# Altium project dashcam_cpu_v2.0.PrjPcb (part 3 of 13)

## Sheet mx8m_io.SchDoc
size A2; SheetNumber: 7; SheetTotal: 15
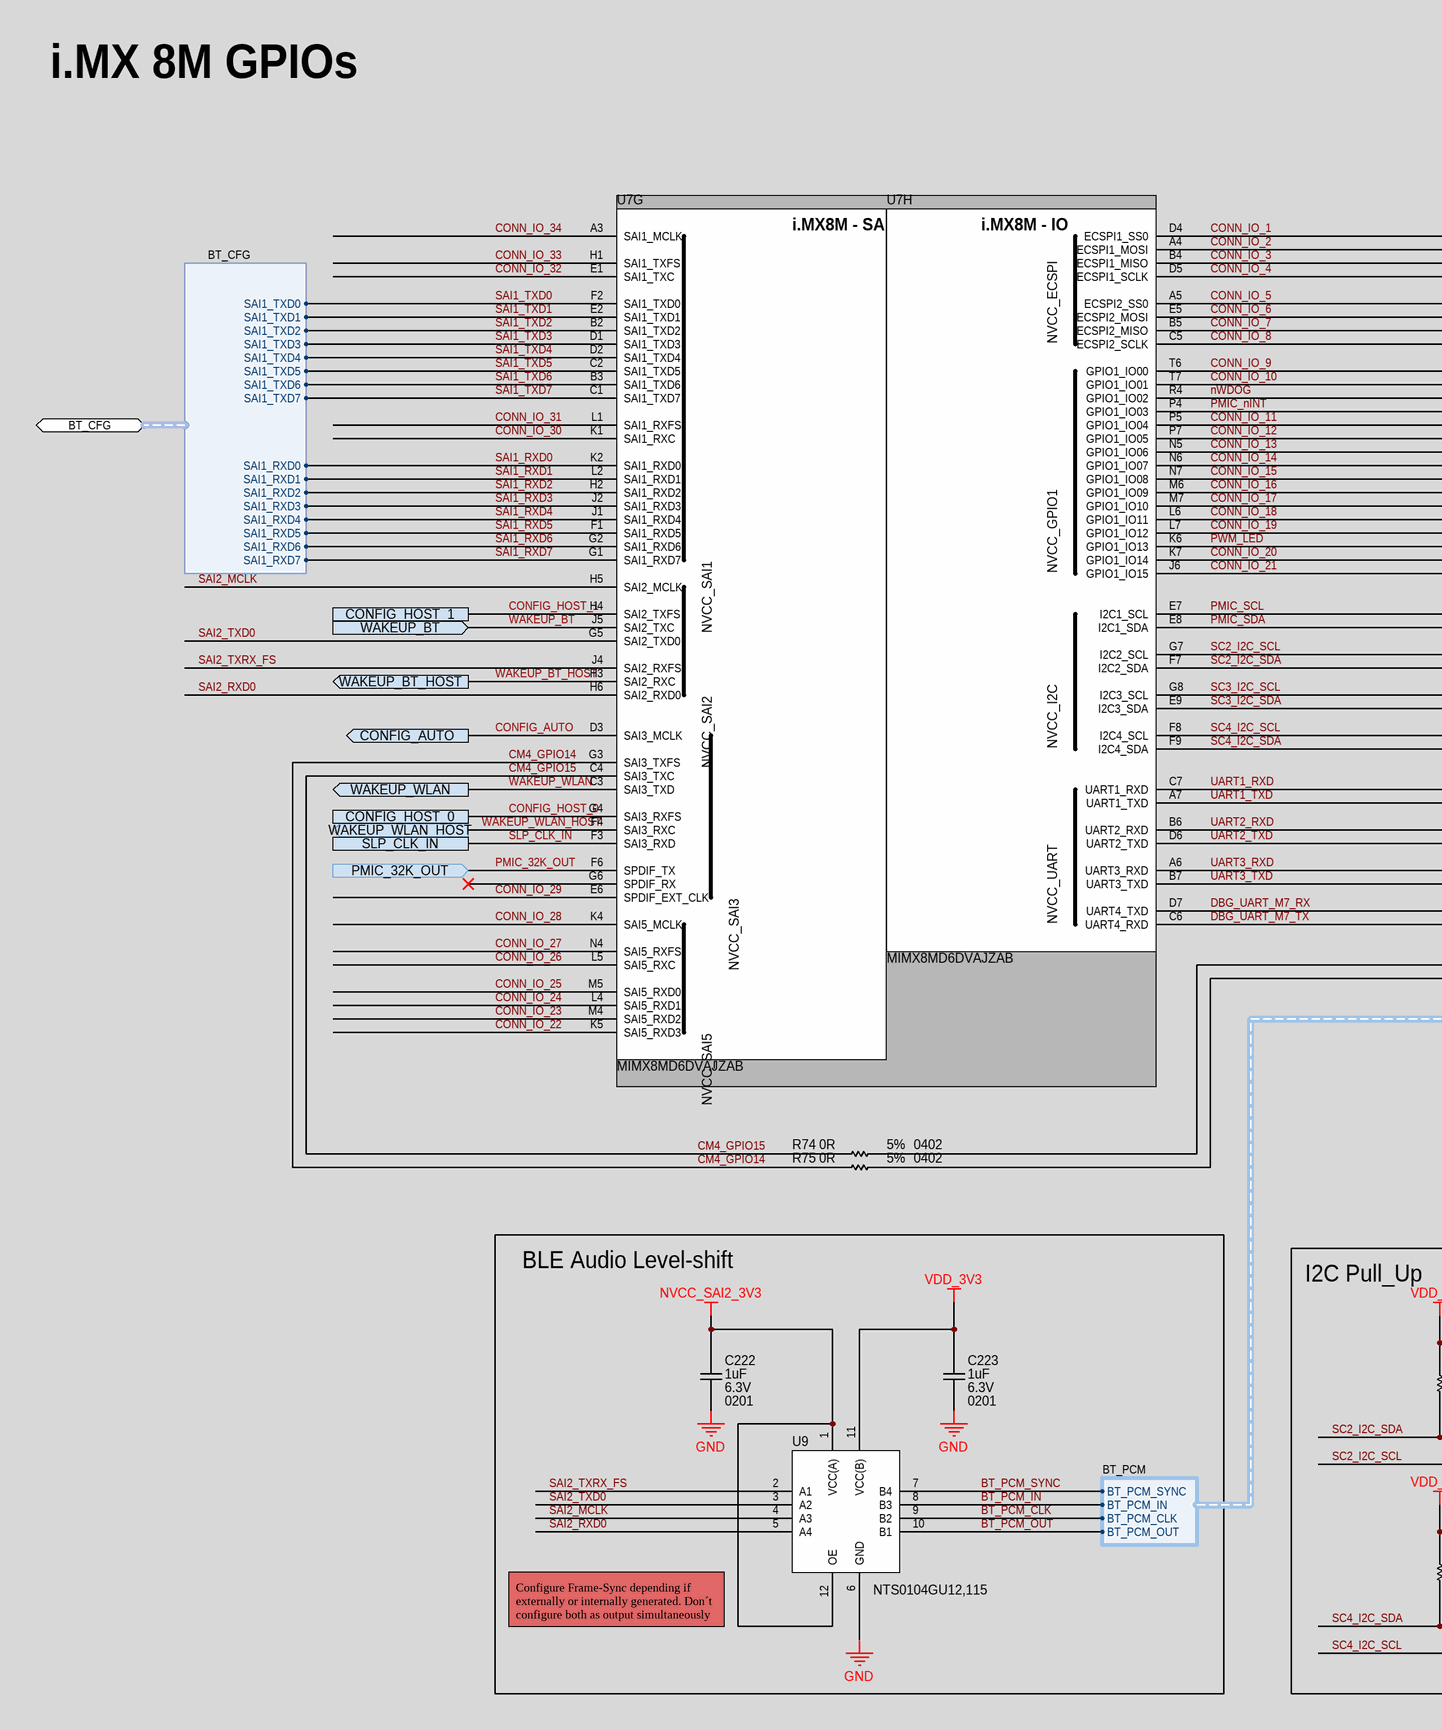
[diagram p4: mx8m_io.SchDoc, left]
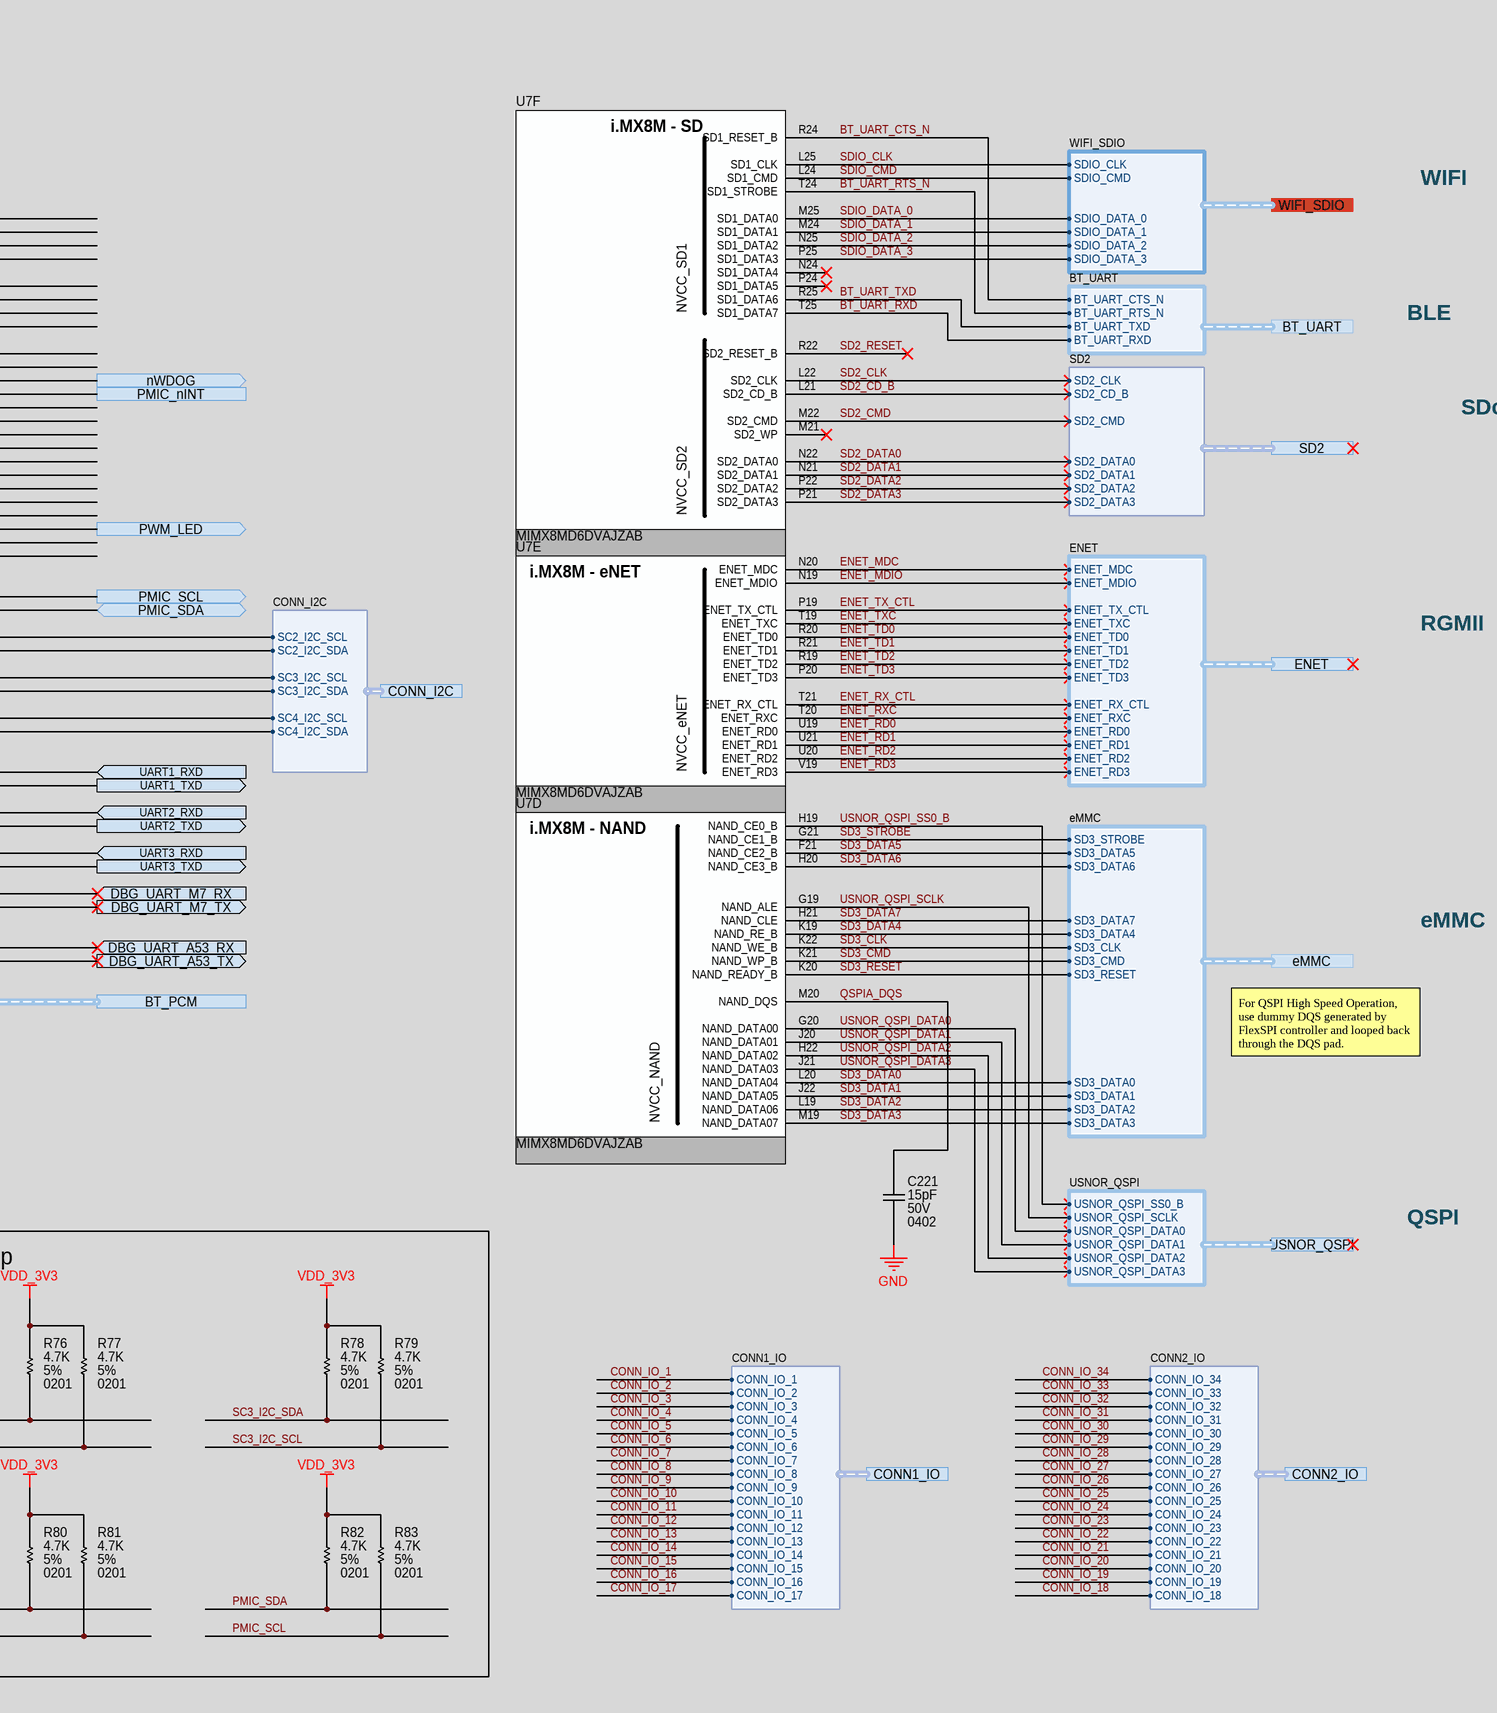
[diagram p5: mx8m_io.SchDoc, right]

### Parts
C221  Voltage: 50V  Capacitance: 15pF  Case/Package: 0402  [CAP_0402_CAPC1005X05N]  (hidden comment: CC0402JRNPO9BN150)
C222  Voltage Rating (DC): 6.3V  Capacitance: 1uF  Case/Package: 0201  [CAP_0201_CAPC0603X03N]  (hidden comment: 02016D105MAT2A)
C223  Voltage Rating (DC): 6.3V  Capacitance: 1uF  Case/Package: 0201  [CAP_0201_CAPC0603X03N]  (hidden comment: 02016D105MAT2A)
R74  Case Code (Imperial): 0402  Tolerance: 5%  Resistance: 0R  [RES_0402_RESC1005X04N]  (hidden comment: ERJ-2GE0R00X)
R75  Case Code (Imperial): 0402  Tolerance: 5%  Resistance: 0R  [RES_0402_RESC1005X04N]  (hidden comment: ERJ-2GE0R00X)
R76  Tolerance: 5%  Resistance: 4.7K  Case/Package: 0201  [RES_0201_RESC0603X02N]  (hidden comment: RK73B1HTTC472J)
R77  Tolerance: 5%  Resistance: 4.7K  Case/Package: 0201  [RES_0201_RESC0603X02N]  (hidden comment: RK73B1HTTC472J)
R78  Tolerance: 5%  Resistance: 4.7K  Case/Package: 0201  [RES_0201_RESC0603X02N]  (hidden comment: RK73B1HTTC472J)
R79  Tolerance: 5%  Resistance: 4.7K  Case/Package: 0201  [RES_0201_RESC0603X02N]  (hidden comment: RK73B1HTTC472J)
R80  Tolerance: 5%  Resistance: 4.7K  Case/Package: 0201  [RES_0201_RESC0603X02N]  (hidden comment: RK73B1HTTC472J)
R81  Tolerance: 5%  Resistance: 4.7K  Case/Package: 0201  [RES_0201_RESC0603X02N]  (hidden comment: RK73B1HTTC472J)
R82  Tolerance: 5%  Resistance: 4.7K  Case/Package: 0201  [RES_0201_RESC0603X02N]  (hidden comment: RK73B1HTTC472J)
R83  Tolerance: 5%  Resistance: 4.7K  Case/Package: 0201  [RES_0201_RESC0603X02N]  (hidden comment: RK73B1HTTC472J)
U7  MIMX8MD6DVAJZAB  [IC_MPU_BGA621C65P25X25_1700X1700X218]  (parts D,E,F,G,H of 14)
U9  NTS0104GU12,115  [IC_LEVEL_TRASLATOR_XQFN12_0P4_1P8X2P1]

### Blocks framed on the sheet
BLE Audio Level-shift: C222 C223 U9
I2C Pull_Up: R76-R83

### Ports
BT_CFG (bidir, harness BT_CFG), BT_PCM (harness BT_PCM), BT_UART (harness BT_UART), CONFIG_AUTO (out), CONFIG_HOST_0, CONFIG_HOST_1, CONN1_IO (harness CONN1_IO), CONN2_IO (harness CONN2_IO), CONN_I2C (harness CONN_I2C), DBG_UART_A53_RX (in), DBG_UART_A53_TX (out), DBG_UART_M7_RX (in), DBG_UART_M7_TX (out), eMMC (harness eMMC), ENET (harness ENET), nWDOG (out), PMIC_32K_OUT (in), PMIC_nINT, PMIC_SCL (out), PMIC_SDA (bidir), PWM_LED (out), SD2 (harness SD2), SLP_CLK_IN, UART1_RXD (in), UART1_TXD (out), UART2_RXD (in), UART2_TXD (out), UART3_RXD (in), UART3_TXD (out), USNOR_QSPI (harness USNOR_QSPI), WAKEUP_BT (in), WAKEUP_BT_HOST (out), WAKEUP_WLAN (out), WAKEUP_WLAN_HOST (out), WIFI_SDIO (harness WIFI_SDIO)

### Harnesses
WIFI_SDIO: SDIO_CLK, SDIO_CMD, SDIO_DATA_0, SDIO_DATA_1, SDIO_DATA_2, SDIO_DATA_3
BT_UART: BT_UART_CTS_N, BT_UART_RTS_N, BT_UART_TXD, BT_UART_RXD
SD2: SD2_CLK, SD2_CD_B, SD2_CMD, SD2_DATA0, SD2_DATA1, SD2_DATA2, SD2_DATA3
ENET: ENET_MDC, ENET_MDIO, ENET_TX_CTL, ENET_TXC, ENET_TD0, ENET_TD1, ENET_TD2, ENET_TD3, ENET_RX_CTL, ENET_RXC, ENET_RD0, ENET_RD1, ENET_RD2, ENET_RD3
eMMC: SD3_STROBE, SD3_DATA5, SD3_DATA6, SD3_DATA7, SD3_DATA4, SD3_CLK, SD3_CMD, SD3_RESET, SD3_DATA1, SD3_DATA2, SD3_DATA3, SD3_DATA0
USNOR_QSPI: USNOR_QSPI_SS0_B, USNOR_QSPI_SCLK, USNOR_QSPI_DATA0, USNOR_QSPI_DATA1, USNOR_QSPI_DATA2, USNOR_QSPI_DATA3
BT_PCM: BT_PCM_SYNC, BT_PCM_IN, BT_PCM_CLK, BT_PCM_OUT
BT_CFG: SAI1_RXD0, SAI1_RXD1, SAI1_RXD2, SAI1_RXD3, SAI1_RXD4, SAI1_RXD5, SAI1_RXD6, SAI1_RXD7, SAI1_TXD0, SAI1_TXD1, SAI1_TXD2, SAI1_TXD3, SAI1_TXD4, SAI1_TXD5, SAI1_TXD6, SAI1_TXD7
CONN_I2C: SC2_I2C_SCL, SC2_I2C_SDA, SC3_I2C_SCL, SC3_I2C_SDA, SC4_I2C_SCL, SC4_I2C_SDA
CONN1_IO: CONN_IO_1, CONN_IO_2, CONN_IO_3, CONN_IO_4, CONN_IO_5, CONN_IO_6, CONN_IO_7, CONN_IO_8, CONN_IO_9, CONN_IO_10, CONN_IO_11, CONN_IO_12, CONN_IO_13, CONN_IO_14, CONN_IO_15, CONN_IO_16, CONN_IO_17
CONN2_IO: CONN_IO_34, CONN_IO_33, CONN_IO_32, CONN_IO_31, CONN_IO_30, CONN_IO_29, CONN_IO_28, CONN_IO_27, CONN_IO_26, CONN_IO_25, CONN_IO_24, CONN_IO_23, CONN_IO_22, CONN_IO_21, CONN_IO_20, CONN_IO_19, CONN_IO_18

### Nets
GND: C221.1 C222.1 C223.1 U9.6(GND)
NVCC_SAI2_3V3: C222.2 U9.1(VCC(A)) U9.12(OE)
VDD_3V3: C223.2 R76.2 R77.2 R78.2 R79.2 R80.2 R81.2 R82.2 R83.2 U9.11(VCC(B))
BT_PCM_CLK: U9.9(B2) ; port BT_PCM.BT_PCM_CLK
BT_PCM_IN: U9.8(B3) ; port BT_PCM.BT_PCM_IN
BT_PCM_OUT: U9.10(B1) ; port BT_PCM.BT_PCM_OUT
BT_PCM_SYNC: U9.7(B4) ; port BT_PCM.BT_PCM_SYNC
BT_UART_CTS_N: U7.R24(SD1_RESET_B) ; port BT_UART.BT_UART_CTS_N
BT_UART_RTS_N: U7.T24(SD1_STROBE) ; port BT_UART.BT_UART_RTS_N
BT_UART_RXD: U7.T25(SD1_DATA7) ; port BT_UART.BT_UART_RXD
BT_UART_TXD: U7.R25(SD1_DATA6) ; port BT_UART.BT_UART_TXD
CM4_GPIO14: R75.1 U7.G3(SAI3_TXFS)
CM4_GPIO15: R74.1 U7.C4(SAI3_TXC)
CONFIG_AUTO: U7.D3(SAI3_MCLK) ; port CONFIG_AUTO
CONFIG_HOST_0: U7.G4(SAI3_RXFS) ; port CONFIG_HOST_0
CONFIG_HOST_1: U7.H4(SAI2_TXFS) ; port CONFIG_HOST_1
CONN_IO_1: U7.D4(ECSPI1_SS0) ; port CONN1_IO.CONN_IO_1
CONN_IO_2: U7.A4(ECSPI1_MOSI) ; port CONN1_IO.CONN_IO_2
CONN_IO_3: U7.B4(ECSPI1_MISO) ; port CONN1_IO.CONN_IO_3
CONN_IO_4: U7.D5(ECSPI1_SCLK) ; port CONN1_IO.CONN_IO_4
CONN_IO_5: U7.A5(ECSPI2_SS0) ; port CONN1_IO.CONN_IO_5
CONN_IO_6: U7.E5(ECSPI2_MOSI) ; port CONN1_IO.CONN_IO_6
CONN_IO_7: U7.B5(ECSPI2_MISO) ; port CONN1_IO.CONN_IO_7
CONN_IO_8: U7.C5(ECSPI2_SCLK) ; port CONN1_IO.CONN_IO_8
CONN_IO_9: U7.T6(GPIO1_IO00) ; port CONN1_IO.CONN_IO_9
CONN_IO_10: U7.T7(GPIO1_IO01) ; port CONN1_IO.CONN_IO_10
CONN_IO_11: U7.P5(GPIO1_IO04) ; port CONN1_IO.CONN_IO_11
CONN_IO_12: U7.P7(GPIO1_IO05) ; port CONN1_IO.CONN_IO_12
CONN_IO_13: U7.N5(GPIO1_IO06) ; port CONN1_IO.CONN_IO_13
CONN_IO_14: U7.N6(GPIO1_IO07) ; port CONN1_IO.CONN_IO_14
CONN_IO_15: U7.N7(GPIO1_IO08) ; port CONN1_IO.CONN_IO_15
CONN_IO_16: U7.M6(GPIO1_IO09) ; port CONN1_IO.CONN_IO_16
CONN_IO_17: U7.M7(GPIO1_IO10) ; port CONN1_IO.CONN_IO_17
CONN_IO_18: U7.L6(GPIO1_IO11) ; port CONN2_IO.CONN_IO_18
CONN_IO_19: U7.L7(GPIO1_IO12) ; port CONN2_IO.CONN_IO_19
CONN_IO_20: U7.K7(GPIO1_IO14) ; port CONN2_IO.CONN_IO_20
CONN_IO_21: U7.J6(GPIO1_IO15) ; port CONN2_IO.CONN_IO_21
CONN_IO_22: U7.K5(SAI5_RXD3) ; port CONN2_IO.CONN_IO_22
CONN_IO_23: U7.M4(SAI5_RXD2) ; port CONN2_IO.CONN_IO_23
CONN_IO_24: U7.L4(SAI5_RXD1) ; port CONN2_IO.CONN_IO_24
CONN_IO_25: U7.M5(SAI5_RXD0) ; port CONN2_IO.CONN_IO_25
CONN_IO_26: U7.L5(SAI5_RXC) ; port CONN2_IO.CONN_IO_26
CONN_IO_27: U7.N4(SAI5_RXFS) ; port CONN2_IO.CONN_IO_27
CONN_IO_28: U7.K4(SAI5_MCLK) ; port CONN2_IO.CONN_IO_28
CONN_IO_29: U7.E6(SPDIF_EXT_CLK) ; port CONN2_IO.CONN_IO_29
CONN_IO_30: U7.K1(SAI1_RXC) ; port CONN2_IO.CONN_IO_30
CONN_IO_31: U7.L1(SAI1_RXFS) ; port CONN2_IO.CONN_IO_31
CONN_IO_32: U7.E1(SAI1_TXC) ; port CONN2_IO.CONN_IO_32
CONN_IO_33: U7.H1(SAI1_TXFS) ; port CONN2_IO.CONN_IO_33
CONN_IO_34: U7.A3(SAI1_MCLK) ; port CONN2_IO.CONN_IO_34
DBG_UART_M7_RX: U7.D7(UART4_TXD) ; port DBG_UART_M7_RX
DBG_UART_M7_TX: U7.C6(UART4_RXD) ; port DBG_UART_M7_TX
ENET_MDC: U7.N20(ENET_MDC) ; port ENET.ENET_MDC
ENET_MDIO: U7.N19(ENET_MDIO) ; port ENET.ENET_MDIO
ENET_RD0: U7.U19(ENET_RD0) ; port ENET.ENET_RD0
ENET_RD1: U7.U21(ENET_RD1) ; port ENET.ENET_RD1
ENET_RD2: U7.U20(ENET_RD2) ; port ENET.ENET_RD2
ENET_RD3: U7.V19(ENET_RD3) ; port ENET.ENET_RD3
ENET_RX_CTL: U7.T21(ENET_RX_CTL) ; port ENET.ENET_RX_CTL
ENET_RXC: U7.T20(ENET_RXC) ; port ENET.ENET_RXC
ENET_TD0: U7.R20(ENET_TD0) ; port ENET.ENET_TD0
ENET_TD1: U7.R21(ENET_TD1) ; port ENET.ENET_TD1
ENET_TD2: U7.R19(ENET_TD2) ; port ENET.ENET_TD2
ENET_TD3: U7.P20(ENET_TD3) ; port ENET.ENET_TD3
ENET_TX_CTL: U7.P19(ENET_TX_CTL) ; port ENET.ENET_TX_CTL
ENET_TXC: U7.T19(ENET_TXC) ; port ENET.ENET_TXC
nWDOG: U7.R4(GPIO1_IO02) ; port nWDOG
PMIC_32K_OUT: U7.F6(SPDIF_TX) ; port PMIC_32K_OUT
PMIC_nINT: U7.P4(GPIO1_IO03) ; port PMIC_nINT
PMIC_SCL: R83.1 U7.E7(I2C1_SCL) ; port PMIC_SCL  [project net I2C1_SCL]
PMIC_SDA: R82.1 U7.E8(I2C1_SDA) ; port PMIC_SDA  [project net I2C1_SDA]
PWM_LED: U7.K6(GPIO1_IO13) ; port PWM_LED
QSPIA_DQS: C221.2 U7.M20(NAND_DQS)
SAI1_RXD0: U7.K2(SAI1_RXD0) ; port BT_CFG.SAI1_RXD0
SAI1_RXD1: U7.L2(SAI1_RXD1) ; port BT_CFG.SAI1_RXD1
SAI1_RXD2: U7.H2(SAI1_RXD2) ; port BT_CFG.SAI1_RXD2
SAI1_RXD3: U7.J2(SAI1_RXD3) ; port BT_CFG.SAI1_RXD3
SAI1_RXD4: U7.J1(SAI1_RXD4) ; port BT_CFG.SAI1_RXD4
SAI1_RXD5: U7.F1(SAI1_RXD5) ; port BT_CFG.SAI1_RXD5
SAI1_RXD6: U7.G2(SAI1_RXD6) ; port BT_CFG.SAI1_RXD6
SAI1_RXD7: U7.G1(SAI1_RXD7) ; port BT_CFG.SAI1_RXD7
SAI1_TXD0: U7.F2(SAI1_TXD0) ; port BT_CFG.SAI1_TXD0
SAI1_TXD1: U7.E2(SAI1_TXD1) ; port BT_CFG.SAI1_TXD1
SAI1_TXD2: U7.B2(SAI1_TXD2) ; port BT_CFG.SAI1_TXD2
SAI1_TXD3: U7.D1(SAI1_TXD3) ; port BT_CFG.SAI1_TXD3
SAI1_TXD4: U7.D2(SAI1_TXD4) ; port BT_CFG.SAI1_TXD4
SAI1_TXD5: U7.C2(SAI1_TXD5) ; port BT_CFG.SAI1_TXD5
SAI1_TXD6: U7.B3(SAI1_TXD6) ; port BT_CFG.SAI1_TXD6
SAI1_TXD7: U7.C1(SAI1_TXD7) ; port BT_CFG.SAI1_TXD7
SAI2_MCLK: U7.H5(SAI2_MCLK) U9.4(A3)
SAI2_RXD0: U7.H6(SAI2_RXD0) U9.5(A4)
SAI2_TXD0: U7.G5(SAI2_TXD0) U9.3(A2)
SAI2_TXRX_FS: U7.J4(SAI2_RXFS) U9.2(A1)
SC2_I2C_SCL: R77.1 U7.G7(I2C2_SCL) ; port CONN_I2C.SC2_I2C_SCL
SC2_I2C_SDA: R76.1 U7.F7(I2C2_SDA) ; port CONN_I2C.SC2_I2C_SDA
SC3_I2C_SCL: R79.1 U7.G8(I2C3_SCL) ; port CONN_I2C.SC3_I2C_SCL
SC3_I2C_SDA: R78.1 U7.E9(I2C3_SDA) ; port CONN_I2C.SC3_I2C_SDA
SC4_I2C_SCL: R81.1 U7.F8(I2C4_SCL) ; port CONN_I2C.SC4_I2C_SCL
SC4_I2C_SDA: R80.1 U7.F9(I2C4_SDA) ; port CONN_I2C.SC4_I2C_SDA
SD2_CD_B: U7.L21(SD2_CD_B) ; port SD2.SD2_CD_B
SD2_CLK: U7.L22(SD2_CLK) ; port SD2.SD2_CLK
SD2_CMD: U7.M22(SD2_CMD) ; port SD2.SD2_CMD
SD2_DATA0: U7.N22(SD2_DATA0) ; port SD2.SD2_DATA0
SD2_DATA1: U7.N21(SD2_DATA1) ; port SD2.SD2_DATA1
SD2_DATA2: U7.P22(SD2_DATA2) ; port SD2.SD2_DATA2
SD2_DATA3: U7.P21(SD2_DATA3) ; port SD2.SD2_DATA3
SD2_RESET: U7.R22(SD2_RESET_B)
SD3_CLK: U7.K22(NAND_WE_B) ; port eMMC.SD3_CLK
SD3_CMD: U7.K21(NAND_WP_B) ; port eMMC.SD3_CMD
SD3_DATA0: U7.L20(NAND_DATA04) ; port eMMC.SD3_DATA0
SD3_DATA1: U7.J22(NAND_DATA05) ; port eMMC.SD3_DATA1
SD3_DATA2: U7.L19(NAND_DATA06) ; port eMMC.SD3_DATA2
SD3_DATA3: U7.M19(NAND_DATA07) ; port eMMC.SD3_DATA3
SD3_DATA4: U7.K19(NAND_RE_B) ; port eMMC.SD3_DATA4
SD3_DATA5: U7.F21(NAND_CE2_B) ; port eMMC.SD3_DATA5
SD3_DATA6: U7.H20(NAND_CE3_B) ; port eMMC.SD3_DATA6
SD3_DATA7: U7.H21(NAND_CLE) ; port eMMC.SD3_DATA7
SD3_RESET: U7.K20(NAND_READY_B) ; port eMMC.SD3_RESET
SD3_STROBE: U7.G21(NAND_CE1_B) ; port eMMC.SD3_STROBE
SDIO_CLK: U7.L25(SD1_CLK) ; port WIFI_SDIO.SDIO_CLK
SDIO_CMD: U7.L24(SD1_CMD) ; port WIFI_SDIO.SDIO_CMD
SDIO_DATA_0: U7.M25(SD1_DATA0) ; port WIFI_SDIO.SDIO_DATA_0
SDIO_DATA_1: U7.M24(SD1_DATA1) ; port WIFI_SDIO.SDIO_DATA_1
SDIO_DATA_2: U7.N25(SD1_DATA2) ; port WIFI_SDIO.SDIO_DATA_2
SDIO_DATA_3: U7.P25(SD1_DATA3) ; port WIFI_SDIO.SDIO_DATA_3
SLP_CLK_IN: U7.F3(SAI3_RXD) ; port SLP_CLK_IN
UART1_RXD: U7.C7(UART1_RXD) ; port UART1_RXD
UART1_TXD: U7.A7(UART1_TXD) ; port UART1_TXD
UART2_RXD: U7.B6(UART2_RXD) ; port UART2_RXD
UART2_TXD: U7.D6(UART2_TXD) ; port UART2_TXD
UART3_RXD: U7.A6(UART3_RXD) ; port UART3_RXD
UART3_TXD: U7.B7(UART3_TXD) ; port UART3_TXD
USNOR_QSPI_DATA0: U7.G20(NAND_DATA00) ; port USNOR_QSPI.USNOR_QSPI_DATA0
USNOR_QSPI_DATA1: U7.J20(NAND_DATA01) ; port USNOR_QSPI.USNOR_QSPI_DATA1
USNOR_QSPI_DATA2: U7.H22(NAND_DATA02) ; port USNOR_QSPI.USNOR_QSPI_DATA2
USNOR_QSPI_DATA3: U7.J21(NAND_DATA03) ; port USNOR_QSPI.USNOR_QSPI_DATA3
USNOR_QSPI_SCLK: U7.G19(NAND_ALE) ; port USNOR_QSPI.USNOR_QSPI_SCLK
USNOR_QSPI_SS0_B: U7.H19(NAND_CE0_B) ; port USNOR_QSPI.USNOR_QSPI_SS0_B
WAKEUP_BT: U7.J5(SAI2_TXC) ; port WAKEUP_BT
WAKEUP_BT_HOST: U7.H3(SAI2_RXC) ; port WAKEUP_BT_HOST
WAKEUP_WLAN: U7.C3(SAI3_TXD) ; port WAKEUP_WLAN
WAKEUP_WLAN_HOST: U7.F4(SAI3_RXC) ; port WAKEUP_WLAN_HOST
NetR74_2: R74.2 ; port DBG_UART_A53_RX
NetR75_2: R75.2 ; port DBG_UART_A53_TX

Not connected (* = marked no-connect by the designer): U7 G6(SPDIF_RX)* M21(SD2_WP)* N24(SD1_DATA4)* P24(SD1_DATA5)*

### Notes on the sheet
- i.MX 8M GPIOs
- WIFI
- BLE
- SDcard external
- RGMII
- eMMC
- For QSPI High Speed Operation, use dummy DQS generated by FlexSPI controller and looped back through the DQS pad.
- QSPI
- Configure Frame-Sync depending if externally or internally generated. Don´t configure both as output simultaneously
- PCB Des :
- Approv By :
- Project Title :
- Sheet Title :
- Date :
- Page :
- PCB Version :
- PCB Revision :
- Size :
- A2
- (in symbol IC_MPU_ARM_1.5GHZ_MIMX8MD6DVAJZAB, part D) i.MX8M - NAND; NVCC_NAND
- (in symbol IC_MPU_ARM_1.5GHZ_MIMX8MD6DVAJZAB, part E) i.MX8M - eNET; NVCC_eNET
- (in symbol IC_MPU_ARM_1.5GHZ_MIMX8MD6DVAJZAB, part F) i.MX8M - SD; NVCC_SD1
- (in symbol IC_MPU_ARM_1.5GHZ_MIMX8MD6DVAJZAB, part G) i.MX8M - SAI; NVCC_SAI1
- (in symbol IC_MPU_ARM_1.5GHZ_MIMX8MD6DVAJZAB, part H) i.MX8M - IO; NVCC_GPIO1

### Library data of the parts
C221 = CAP_15PF_50V_NP0_0402: Multilayer Ceramic Capacitor, 15 pF, 50 V, ± 5%,NP0, 0402 [1005 Metric]; Manufacturer: Yageo; Dielectric: C0G; Insulation Resistance: 100GR; Supplier 1: Digi-Key; Manufacturer Part Number: CC0402JRNPO9BN150; RoHS: Yes; Category: Ceramic Capacitors; Stock 1: 919349; Pricing 1: 10=0.023, 50=0.013, 100=0.0101, 500=0.00764, 1000=0.006, 2500=0.00546, 5000=0.00502 (USD); Mount: Surface Mount; Number of Pins: 2; Case Code (Metric): 1005; Case Code (Imperial): 0402; Dielectric Material: Ceramic; Min Operating Temperature: -55°C; Max Operating Temperature: 125°C; Tolerance: 5%; Series: CC; Voltage Rating: 50V; Voltage Rating (DC): 50V; Package Quantity: 1; Packaging: Tape and Reel; Termination: SMD/SMT; Length: 1mm; Width: 0.02inch; Height: 0.5mm; Depth: 0.5mm; Thickness: 0.022inch; Radiation Hardening: No; Lead Free: Lead Free; RoHS Compliant: Yes; Reach SVHC Compliant: No; ComponentLink1URL: https://datasheet.ciiva.com/5789/1443161-5789504.pdf?src-supplier=Farnell; ComponentLink1Description: https://datasheet.ciiva.com/5789/1443161-5789504.pdf?src-supplier=Farnell; ComponentLink2URL: https://datasheet.ciiva.com/26862/getdatasheetpartid-403449-26862595.pdf?src-supplier=Verical; ComponentLink2Description: https://datasheet.ciiva.com/26862/getdatasheetpartid-403449-26862595.pdf?src-supplier=Verical; ComponentLink3URL: https://datasheet.ciiva.com/144/mlccorderingcode-144002.pdf?src-supplier=Digi-Key; ComponentLink3Description: https://datasheet.ciiva.com/144/mlccorderingcode-144002.pdf?src-supplier=Digi-Key; ComponentLink4URL: https://datasheet.ciiva.com/144/mlccorderingcode-144001.pdf?src-supplier=Digi-Key; ComponentLink4Description: https://datasheet.ciiva.com/144/mlccorderingcode-144001.pdf?src-supplier=Digi-Key; ComponentLink5URL: https://datasheet.ciiva.com/13386/upy-gp-np0-16v-to-50v-8-13386330.pdf?src-supplier=Mouser; ComponentLink5Description: https://datasheet.ciiva.com/13386/upy-gp-np0-16v-to-50v-8-13386330.pdf?src-supplier=Mouser; ComponentLink6URL: https://datasheet.ciiva.com/11587/upy-gp-np0-16v-to-50v-8-11587085.pdf?src-supplier=Avnet; ComponentLink6Description: https://datasheet.ciiva.com/11587/upy-gp-np0-16v-to-50v-8-11587085.pdf?src-supplier=Avnet; ComponentLink7URL: https://datasheet.ciiva.com/144/mlccorderingcode-144003.pdf?src-supplier=Digi-Key; ComponentLink7Description: https://datasheet.ciiva.com/144/mlccorderingcode-144003.pdf?src-supplier=Digi-Key; Supplier Part Number 1: 311-1017-1-ND
C222 C223 = CAP_1UF_6.3V_X5R_0201: 0201 1 uF 6.3 V ±20 % Tolerance X5R Surface Mount Multilayer Ceramic Capacitor; Manufacturer: Kyocera AVX; Tolerance: 20%; Supplier 1: Mouser; Manufacturer Part Number: 02016D105MAT2A; RoHS: Yes; Category: Ceramic Capacitors; Stock 1: 1026413; Pricing 1: 1=0.1, 10=0.028, 50=0.028, 100=0.014, 1000=0.008, 10000=0.006 (USD); Mount: Surface Mount; Number of Pins: 2; Case Code (Metric): 0603; Case Code (Imperial): 0201; Min Operating Temperature: -55°C; Max Operating Temperature: 85°C; Packaging: Cut Tape; Series: -; Voltage Rating: 6.3V; Package Quantity: 1; Length: 0.024inch; Width: 0.012inch; Thickness: 0.013inch; Depth: 0.3mm; Lead Free: Lead Free; RoHS Compliant: Yes; Reach SVHC Compliant: No; ComponentLink1URL: https://datasheet.ciiva.com/6265/cx5r-6265595.pdf?src-supplier=Digi-Key; ComponentLink1Description: https://datasheet.ciiva.com/6265/cx5r-6265595.pdf?src-supplier=Digi-Key; ComponentLink2URL: https://datasheet.ciiva.com/1123/1666675-1123122.pdf?src-supplier=Element14; ComponentLink2Description: https://datasheet.ciiva.com/1123/1666675-1123122.pdf?src-supplier=Element14; ComponentLink3URL: https://datasheet.ciiva.com/14891/cx5r-14891029.pdf?src-supplier=Digi-Key; ComponentLink3Description: https://datasheet.ciiva.com/14891/cx5r-14891029.pdf?src-supplier=Digi-Key; ComponentLink4URL: https://datasheet.ciiva.com/7614/cx5r-7614682.pdf?src-supplier=Digi-Key; ComponentLink4Description: https://datasheet.ciiva.com/7614/cx5r-7614682.pdf?src-supplier=Digi-Key; ComponentLink5URL: https://datasheet.ciiva.com/14891/cx5r-14891030.pdf?src-supplier=Digi-Key; ComponentLink5Description: https://datasheet.ciiva.com/14891/cx5r-14891030.pdf?src-supplier=Digi-Key; Supplier Part Number 1: 581-02016D105MAT2A; Dielectric: X5R
R74 R75 = RES_0R_5%_100mW_0402: as R59 on sheet mx8m_cfg; Supplier 1: Mouser; Manufacturer Part Number: ERJ-2GE0R00X; RoHS: Yes; Category: Chip SMD Resistors; Stock 1: 10989354; Pricing 1: 1=0.1, 10=0.013, 50=0.013, 100=0.006, 1000=0.004, 2500=0.003, 10000=0.003 (USD); Mount: Surface Mount; Case/Package: 0402; Contact Plating: Tin; Case Code (Metric): 1005; Size Code: 0402; Min Operating Temperature: -55°C; Max Operating Temperature: 155°C; Resistor Type: Thick Film; Packaging: Cut Tape; Package Quantity: 10000; Number of Terminations: 2; Termination: SMD/SMT; Max Power Dissipation: 100mW; Voltage Rating (DC): 50V; Features: Automotive AEC-Q200; Series: ERJ; Construction: Rectangular; Technology: THICK FILM; Length: 1mm; Width: 0.5mm; Height: 0.35mm; Depth: 0.5mm; Ratings: AEC-Q200; Radiation Hardening: No; Reach SVHC Compliant: No; Military Standard: Not; Lead Free: Lead Free; RoHS Compliant: Yes; ComponentLink1URL: https://datasheet.ciiva.com/11821/0900766b80f806dd-11821176.pdf?src-supplier=Rs; ComponentLink1Description: https://datasheet.ciiva.com/11821/0900766b80f806dd-11821176.pdf?src-supplier=Rs; ComponentLink2URL: https://datasheet.ciiva.com/43460/1678796-43460347.pdf?src-supplier=Farnell; ComponentLink2Description: https://datasheet.ciiva.com/43460/1678796-43460347.pdf?src-supplier=Farnell; ComponentLink3URL: https://datasheet.ciiva.com/46389/1678796-46389518.pdf?src-supplier=Element14; ComponentLink3Description: https://datasheet.ciiva.com/46389/1678796-46389518.pdf?src-supplier=Element14; ComponentLink4URL: https://datasheet.ciiva.com/5959/1678796-5959692.pdf?src-supplier=Farnell; ComponentLink4Description: https://datasheet.ciiva.com/5959/1678796-5959692.pdf?src-supplier=Farnell; ComponentLink5URL: https://datasheet.ciiva.com/28695/1678796-28695758.pdf?src-supplier=Element14; ComponentLink5Description: https://datasheet.ciiva.com/28695/1678796-28695758.pdf?src-supplier=Element14; ComponentLink6URL: https://datasheet.ciiva.com/16783/70260739-16783734.pdf?src-supplier=Allied+Electronics; ComponentLink6Description: https://datasheet.ciiva.com/16783/70260739-16783734.pdf?src-supplier=Allied+Electronics; ComponentLink7URL: https://datasheet.ciiva.com/16778/70260739-16778335.pdf?src-supplier=Allied+Electronics; ComponentLink7Description: https://datasheet.ciiva.com/16778/70260739-16778335.pdf?src-supplier=Allied+Electronics; ComponentLink8URL: https://datasheet.ciiva.com/48531/aoa0000ce1-48531077.pdf?src-supplier=Avnet; ComponentLink8Description: https://datasheet.ciiva.com/48531/aoa0000ce1-48531077.pdf?src-supplier=Avnet; ComponentLink9URL: https://datasheet.ciiva.com/30097/4aoa0000ce1-30097116.pdf?src-supplier=Onlinecomponents.com; ComponentLink9Description: https://datasheet.ciiva.com/30097/4aoa0000ce1-30097116.pdf?src-supplier=Onlinecomponents.com; Supplier Part Number 1: 667-ERJ-2GE0R00X
R76-R83 = RES_4.7K_5%_50mW_0201: as R63 on sheet mx8m_cfg; Supplier 1: Digikey; Manufacturer Part Number: RK73B1HTTC472J; RoHS: Yes; Category: Chip SMD Resistors; Stock 1: 410528; Pricing 1: 1=0.1, 10=0.033, 50=0.021, 100=0.0177, 500=0.01224, 1000=0.0106, 5000=0.00782 (USD); Case Code (Imperial): 0201; Case Code (Metric): 0603; Min Operating Temperature: -55°C; Max Operating Temperature: 125°C; Packaging: Tape and Reel; Termination: SMD/SMT; Voltage Rating (DC): 25V; Series: RK73B; Construction: Rectangular; Length: 0.6mm; Depth: 0.3mm; Military Standard: Not; Lead Free: Lead Free; RoHS Compliant: Yes; ComponentLink1URL: https://datasheet.ciiva.com/5556/rk73b-5556381.pdf?src-supplier=Mouser; ComponentLink1Description: https://datasheet.ciiva.com/5556/rk73b-5556381.pdf?src-supplier=Mouser; Supplier Part Number 1: 2019-RK73B1HTTC472JDKR-ND
U7 = IC_MPU_ARM_1.5GHZ_MIMX8MD6DVAJZAB: as U7 on sheet mx8m_dram; Supplier 1: Digikey; Manufacturer Part Number: MIMX8MD6DVAJZAB; RoHS: Yes; Category: Microprocessors; Stock 1: 162; Pricing 1: 1=56.07, 10=46.184, 25=43.716, 90=41.175 (USD); RoHS Compliant: Yes; Supplier Part Number 1: 568-14717-ND
U9 = IC_LEVEL_TRASLATOR_NTS0104GU12,115: NTS0104 Series 50 Mbps Dual Supply 3-ST O-DRN Translating Transceiver- XQFN-12; Manufacturer: NXP Semiconductors; Logic Function: Translator; Low Level Output Current: 1mA; High Level Output Current: -20uA; Quiescent Current: 45uA; Data Rate: 50Mbps; Number of Channels: 4; Propagation Delay: 4.4ns; Max Supply Voltage: 5.5V; Min Supply Voltage: 1.65V; Max Power Dissipation: 250mW; Turn-On Delay Time: 5.8ns; Output Type: Voltage; Supplier 1: Digikey; Manufacturer Part Number: NTS0104GU12,115; RoHS: Yes; Category: Voltage Level Shifters; Stock 1: 126626; Pricing 1: 1=1.16, 10=1.034, 25=0.982, 100=0.8065, 250=0.75396, 500=0.66628, 1000=0.52601 (USD); Mount: Surface Mount; Number of Pins: 12; Min Operating Temperature: -40°C; Max Operating Temperature: 125°C; Packaging: Tape and Reel; Package Quantity: 1; Number of Bits: 4; Series: -; Lead Free: Lead Free; RoHS Compliant: Yes; ComponentLink1URL: https://datasheet.ciiva.com/1899/nts0104-1899088.pdf?src-supplier=Digikey; ComponentLink1Description: https://datasheet.ciiva.com/1899/nts0104-1899088.pdf?src-supplier=Digikey; ComponentLink2URL: https://datasheet.ciiva.com/4834/nts0104-92130-4834865.pdf?src-supplier=Mouser; ComponentLink2Description: https://datasheet.ciiva.com/4834/nts0104-92130-4834865.pdf?src-supplier=Mouser; ComponentLink3URL: https://datasheet.ciiva.com/1899/nts0104-1899089.pdf?src-supplier=Digikey; ComponentLink3Description: https://datasheet.ciiva.com/1899/nts0104-1899089.pdf?src-supplier=Digikey; ComponentLink4URL: https://datasheet.ciiva.com/1899/nts0104-1899090.pdf?src-supplier=Digikey; ComponentLink4Description: https://datasheet.ciiva.com/1899/nts0104-1899090.pdf?src-supplier=Digikey; ComponentLink5URL: https://datasheet.ciiva.com/8244/nts0104-8244168.pdf?src-supplier=Avnet; ComponentLink5Description: https://datasheet.ciiva.com/8244/nts0104-8244168.pdf?src-supplier=Avnet; Supplier Part Number 1: 568-8408-1-ND

## Sheet mx8m_phy.SchDoc
size A2; SheetNumber: 8; SheetTotal: 15
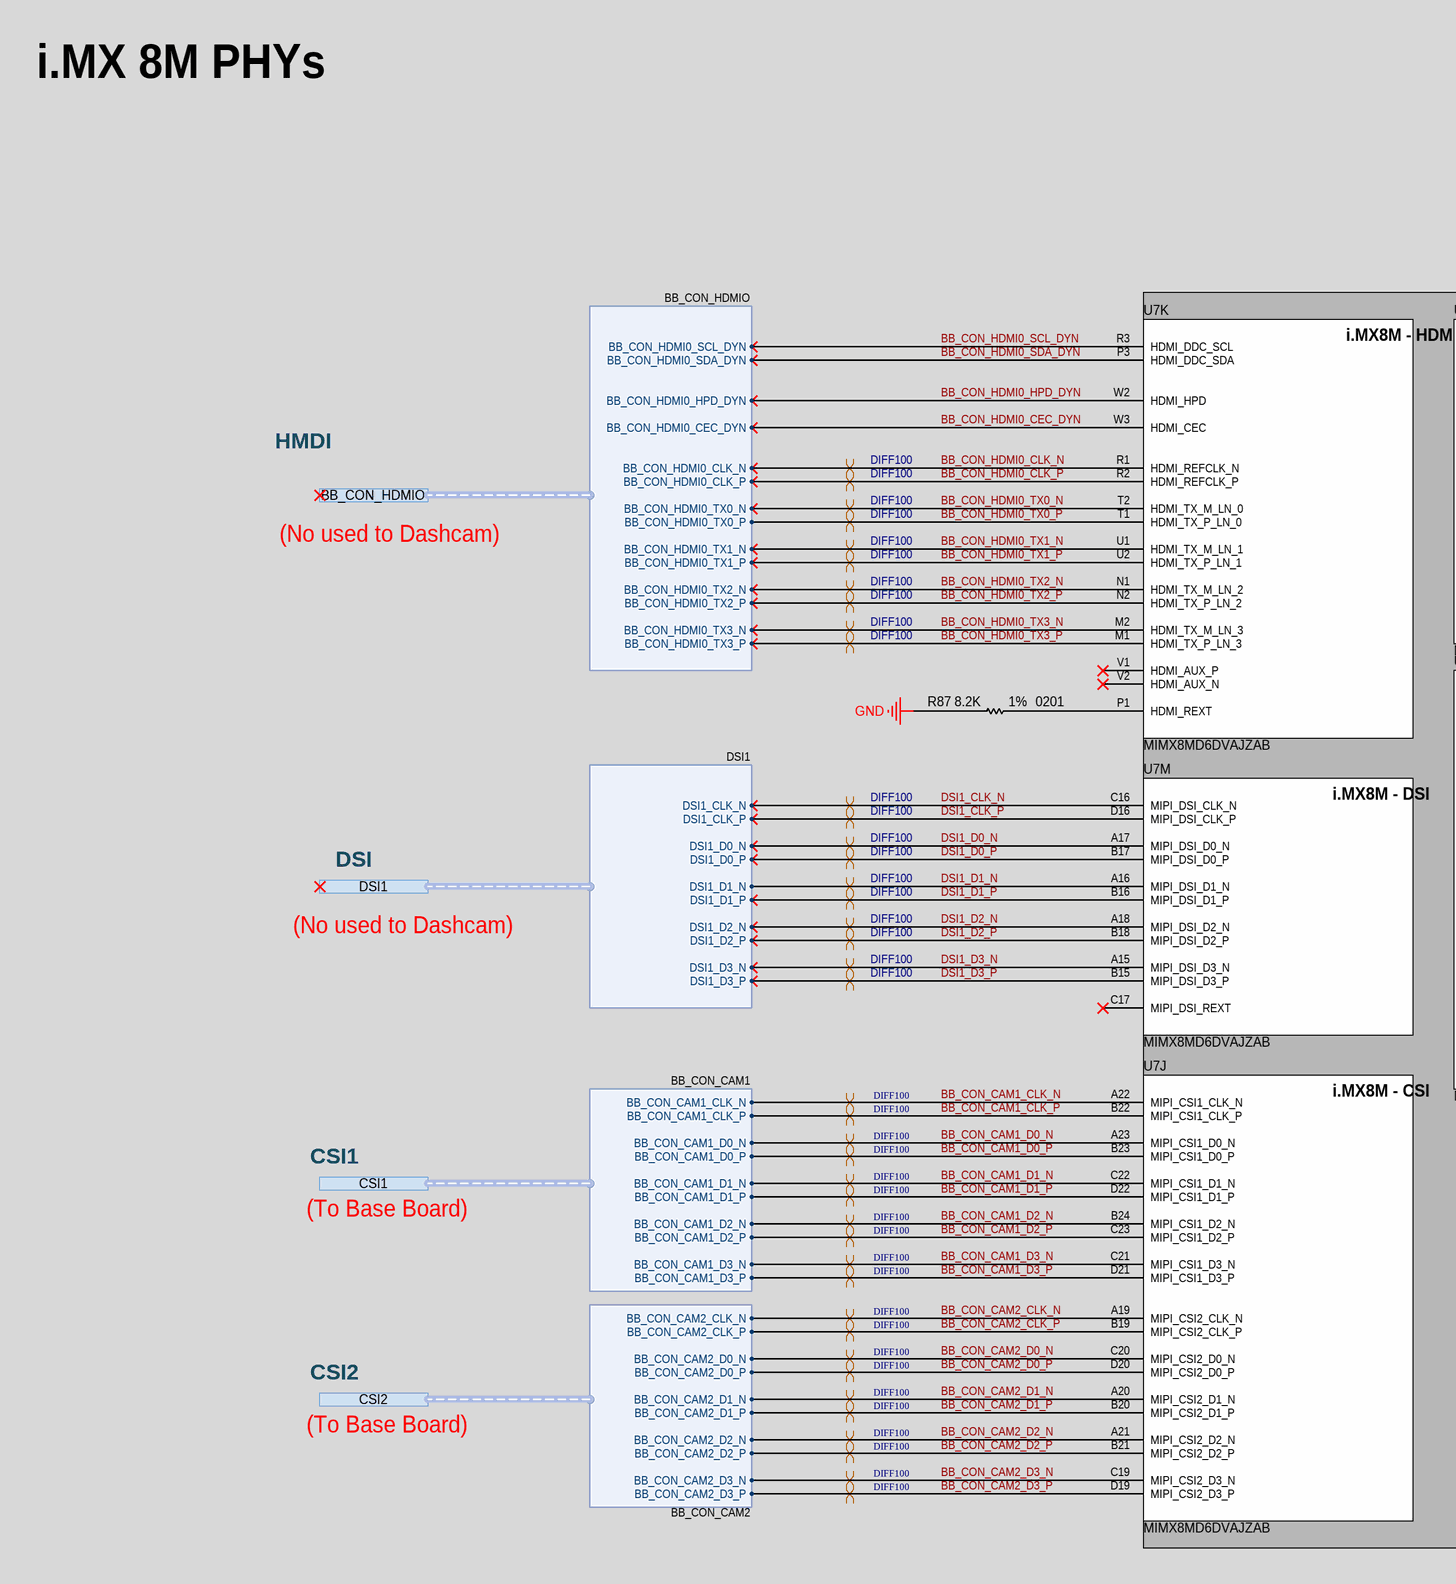
[diagram p6: mx8m_phy.SchDoc, left]
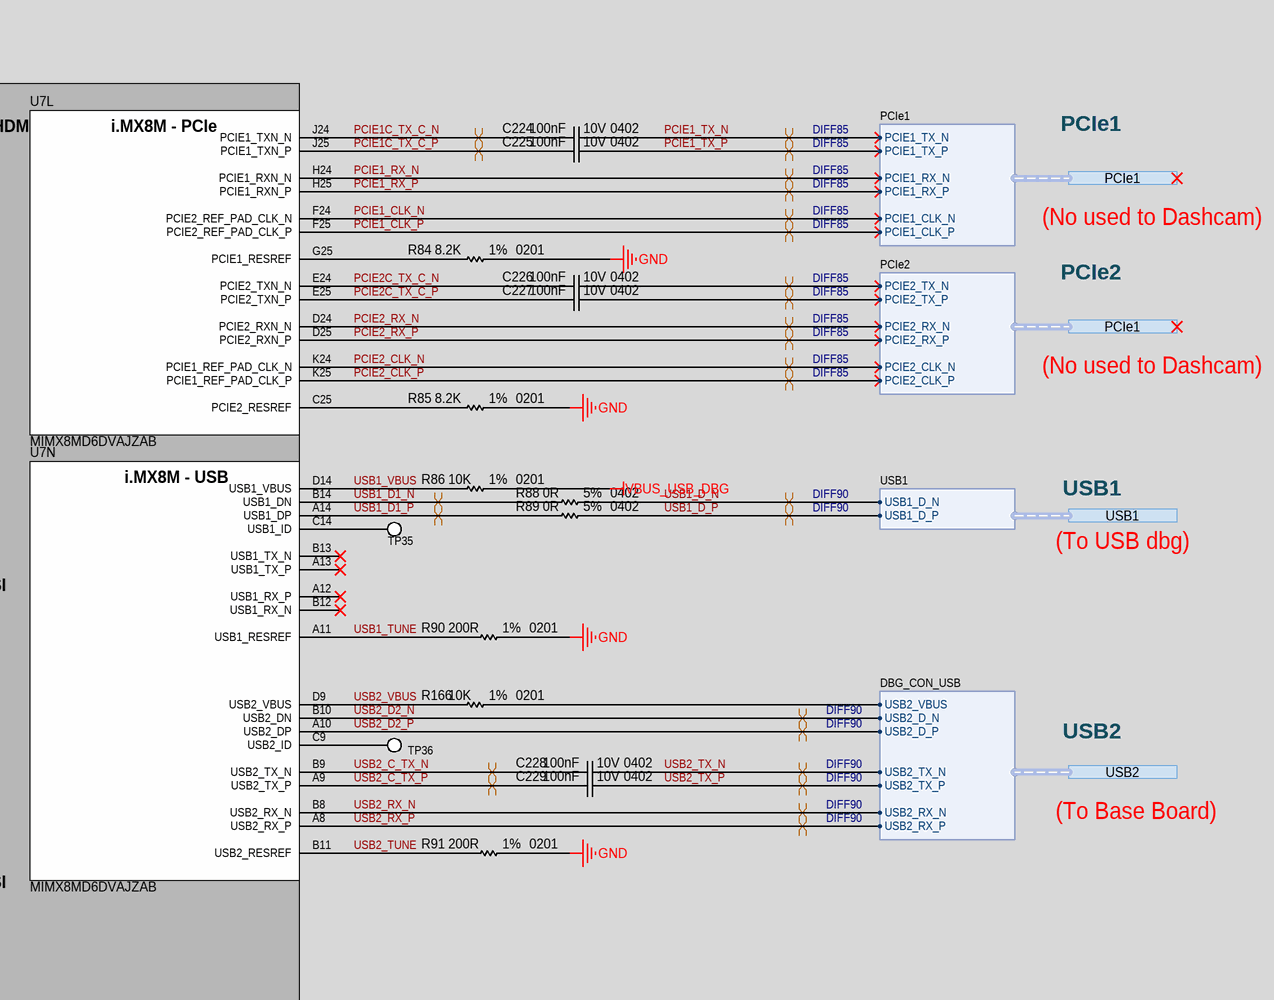
[diagram p7: mx8m_phy.SchDoc, right]

### Parts
C224  Case Code (Imperial): 0402  Voltage Rating (DC): 10V  Capacitance: 100nF  [CAP_0402_CAPC1005X05N]  (hidden comment: GRM155R61A104KA01D)
C225  Case Code (Imperial): 0402  Voltage Rating (DC): 10V  Capacitance: 100nF  [CAP_0402_CAPC1005X05N]  (hidden comment: GRM155R61A104KA01D)
C226  Case Code (Imperial): 0402  Voltage Rating (DC): 10V  Capacitance: 100nF  [CAP_0402_CAPC1005X05N]  (hidden comment: GRM155R61A104KA01D)
C227  Case Code (Imperial): 0402  Voltage Rating (DC): 10V  Capacitance: 100nF  [CAP_0402_CAPC1005X05N]  (hidden comment: GRM155R61A104KA01D)
C228  Case Code (Imperial): 0402  Voltage Rating (DC): 10V  Capacitance: 100nF  [CAP_0402_CAPC1005X05N]  (hidden comment: GRM155R61A104KA01D)
C229  Case Code (Imperial): 0402  Voltage Rating (DC): 10V  Capacitance: 100nF  [CAP_0402_CAPC1005X05N]  (hidden comment: GRM155R61A104KA01D)
R84  Tolerance: 1%  Resistance: 8.2K  Case/Package: 0201  [RES_0201_RESC0603X02N]  (hidden comment: RC0201FR-078K2L)
R85  Tolerance: 1%  Resistance: 8.2K  Case/Package: 0201  [RES_0201_RESC0603X02N]  (hidden comment: RC0201FR-078K2L)
R86  Tolerance: 1%  Resistance: 10K  Case Code (Imperial): 0201  [RES_0201_RESC0603X02N]  (hidden comment: RC0201FR-0710KL)
R87  Tolerance: 1%  Resistance: 8.2K  Case/Package: 0201  [RES_0201_RESC0603X02N]  (hidden comment: RC0201FR-078K2L)
R88  Case Code (Imperial): 0402  Tolerance: 5%  Resistance: 0R  [RES_0402_RESC1005X04N]  (hidden comment: ERJ-2GE0R00X)
R89  Case Code (Imperial): 0402  Tolerance: 5%  Resistance: 0R  [RES_0402_RESC1005X04N]  (hidden comment: ERJ-2GE0R00X)
R90  Tolerance: 1%  Resistance: 200R  Case/Package: 0201  [RES_0201_RESC0603X02N]  (hidden comment: RC0201FR-07200RL)
R91  Tolerance: 1%  Resistance: 200R  Case/Package: 0201  [RES_0201_RESC0603X02N]  (hidden comment: RC0201FR-07200RL)
R166  Tolerance: 1%  Resistance: 10K  Case Code (Imperial): 0201  [RES_0201_RESC0603X02N]  (hidden comment: RC0201FR-0710KL)
TP35  NO COMPONENT  [TP_PAD_1.6MM_SMD_ROUND]  (value not drawn)  (no BOM)
TP36  NO COMPONENT  [TP_PAD_1.6MM_SMD_ROUND]  (value not drawn)  (no BOM)
U7  MIMX8MD6DVAJZAB  [IC_MPU_BGA621C65P25X25_1700X1700X218]  (parts J,K,L,M,N of 14)

### Ports
BB_CON_HDMIO (harness BB_CON_HDMIO), CSI1 (harness BB_CON_CAM1), CSI2 (harness BB_CON_CAM2), DSI1 (harness DSI1), PCIe1 (harness PCIe1), PCIe1 (harness PCIe2), USB1 (harness USB1), USB2 (harness DBG_CON_USB)

### Harnesses
PCIe1: PCIE1_TX_N, PCIE1_TX_P, PCIE1_RX_N, PCIE1_RX_P, PCIE1_CLK_N, PCIE1_CLK_P
PCIe2: PCIE2_TX_N, PCIE2_TX_P, PCIE2_RX_N, PCIE2_RX_P, PCIE2_CLK_N, PCIE2_CLK_P
USB1: USB1_D_N, USB1_D_P
DBG_CON_USB: USB2_VBUS, USB2_D_N, USB2_D_P, USB2_TX_N, USB2_TX_P, USB2_RX_N, USB2_RX_P
BB_CON_HDMIO: BB_CON_HDMI0_SCL_DYN, BB_CON_HDMI0_SDA_DYN, BB_CON_HDMI0_HPD_DYN, BB_CON_HDMI0_CEC_DYN, BB_CON_HDMI0_CLK_N, BB_CON_HDMI0_CLK_P, BB_CON_HDMI0_TX0_N, BB_CON_HDMI0_TX0_P, BB_CON_HDMI0_TX1_N, BB_CON_HDMI0_TX1_P, BB_CON_HDMI0_TX2_N, BB_CON_HDMI0_TX2_P, BB_CON_HDMI0_TX3_N, BB_CON_HDMI0_TX3_P
DSI1: DSI1_CLK_N, DSI1_CLK_P, DSI1_D0_N, DSI1_D0_P, DSI1_D1_N, DSI1_D1_P, DSI1_D2_N, DSI1_D2_P, DSI1_D3_N, DSI1_D3_P
BB_CON_CAM1: BB_CON_CAM1_CLK_N, BB_CON_CAM1_CLK_P, BB_CON_CAM1_D0_N, BB_CON_CAM1_D0_P, BB_CON_CAM1_D1_N, BB_CON_CAM1_D1_P, BB_CON_CAM1_D2_N, BB_CON_CAM1_D2_P, BB_CON_CAM1_D3_N, BB_CON_CAM1_D3_P
BB_CON_CAM2: BB_CON_CAM2_CLK_N, BB_CON_CAM2_CLK_P, BB_CON_CAM2_D0_N, BB_CON_CAM2_D0_P, BB_CON_CAM2_D1_N, BB_CON_CAM2_D1_P, BB_CON_CAM2_D2_N, BB_CON_CAM2_D2_P, BB_CON_CAM2_D3_N, BB_CON_CAM2_D3_P

### Nets
GND: R84.2 R85.2 R87.1 R90.2 R91.2
VBUS_USB_DBG: R86.2
BB_CON_CAM1_CLK_N: U7.A22(MIPI_CSI1_CLK_N) ; port CSI1.BB_CON_CAM1_CLK_N
BB_CON_CAM1_CLK_P: U7.B22(MIPI_CSI1_CLK_P) ; port CSI1.BB_CON_CAM1_CLK_P
BB_CON_CAM1_D0_N: U7.A23(MIPI_CSI1_D0_N) ; port CSI1.BB_CON_CAM1_D0_N
BB_CON_CAM1_D0_P: U7.B23(MIPI_CSI1_D0_P) ; port CSI1.BB_CON_CAM1_D0_P
BB_CON_CAM1_D1_N: U7.C22(MIPI_CSI1_D1_N) ; port CSI1.BB_CON_CAM1_D1_N
BB_CON_CAM1_D1_P: U7.D22(MIPI_CSI1_D1_P) ; port CSI1.BB_CON_CAM1_D1_P
BB_CON_CAM1_D2_N: U7.B24(MIPI_CSI1_D2_N) ; port CSI1.BB_CON_CAM1_D2_N
BB_CON_CAM1_D2_P: U7.C23(MIPI_CSI1_D2_P) ; port CSI1.BB_CON_CAM1_D2_P
BB_CON_CAM1_D3_N: U7.C21(MIPI_CSI1_D3_N) ; port CSI1.BB_CON_CAM1_D3_N
BB_CON_CAM1_D3_P: U7.D21(MIPI_CSI1_D3_P) ; port CSI1.BB_CON_CAM1_D3_P
BB_CON_CAM2_CLK_N: U7.A19(MIPI_CSI2_CLK_N) ; port CSI2.BB_CON_CAM2_CLK_N
BB_CON_CAM2_CLK_P: U7.B19(MIPI_CSI2_CLK_P) ; port CSI2.BB_CON_CAM2_CLK_P
BB_CON_CAM2_D0_N: U7.C20(MIPI_CSI2_D0_N) ; port CSI2.BB_CON_CAM2_D0_N
BB_CON_CAM2_D0_P: U7.D20(MIPI_CSI2_D0_P) ; port CSI2.BB_CON_CAM2_D0_P
BB_CON_CAM2_D1_N: U7.A20(MIPI_CSI2_D1_N) ; port CSI2.BB_CON_CAM2_D1_N
BB_CON_CAM2_D1_P: U7.B20(MIPI_CSI2_D1_P) ; port CSI2.BB_CON_CAM2_D1_P
BB_CON_CAM2_D2_N: U7.A21(MIPI_CSI2_D2_N) ; port CSI2.BB_CON_CAM2_D2_N
BB_CON_CAM2_D2_P: U7.B21(MIPI_CSI2_D2_P) ; port CSI2.BB_CON_CAM2_D2_P
BB_CON_CAM2_D3_N: U7.C19(MIPI_CSI2_D3_N) ; port CSI2.BB_CON_CAM2_D3_N
BB_CON_CAM2_D3_P: U7.D19(MIPI_CSI2_D3_P) ; port CSI2.BB_CON_CAM2_D3_P
BB_CON_HDMI0_CEC_DYN: U7.W3(HDMI_CEC) ; port BB_CON_HDMIO.BB_CON_HDMI0_CEC_DYN
BB_CON_HDMI0_CLK_N: U7.R1(HDMI_REFCLK_N) ; port BB_CON_HDMIO.BB_CON_HDMI0_CLK_N
BB_CON_HDMI0_CLK_P: U7.R2(HDMI_REFCLK_P) ; port BB_CON_HDMIO.BB_CON_HDMI0_CLK_P
BB_CON_HDMI0_HPD_DYN: U7.W2(HDMI_HPD) ; port BB_CON_HDMIO.BB_CON_HDMI0_HPD_DYN
BB_CON_HDMI0_SCL_DYN: U7.R3(HDMI_DDC_SCL) ; port BB_CON_HDMIO.BB_CON_HDMI0_SCL_DYN
BB_CON_HDMI0_SDA_DYN: U7.P3(HDMI_DDC_SDA) ; port BB_CON_HDMIO.BB_CON_HDMI0_SDA_DYN
BB_CON_HDMI0_TX0_N: U7.T2(HDMI_TX_M_LN_0) ; port BB_CON_HDMIO.BB_CON_HDMI0_TX0_N
BB_CON_HDMI0_TX0_P: U7.T1(HDMI_TX_P_LN_0) ; port BB_CON_HDMIO.BB_CON_HDMI0_TX0_P
BB_CON_HDMI0_TX1_N: U7.U1(HDMI_TX_M_LN_1) ; port BB_CON_HDMIO.BB_CON_HDMI0_TX1_N
BB_CON_HDMI0_TX1_P: U7.U2(HDMI_TX_P_LN_1) ; port BB_CON_HDMIO.BB_CON_HDMI0_TX1_P
BB_CON_HDMI0_TX2_N: U7.N1(HDMI_TX_M_LN_2) ; port BB_CON_HDMIO.BB_CON_HDMI0_TX2_N
BB_CON_HDMI0_TX2_P: U7.N2(HDMI_TX_P_LN_2) ; port BB_CON_HDMIO.BB_CON_HDMI0_TX2_P
BB_CON_HDMI0_TX3_N: U7.M2(HDMI_TX_M_LN_3) ; port BB_CON_HDMIO.BB_CON_HDMI0_TX3_N
BB_CON_HDMI0_TX3_P: U7.M1(HDMI_TX_P_LN_3) ; port BB_CON_HDMIO.BB_CON_HDMI0_TX3_P
DSI1_CLK_N: U7.C16(MIPI_DSI_CLK_N) ; port DSI1.DSI1_CLK_N
DSI1_CLK_P: U7.D16(MIPI_DSI_CLK_P) ; port DSI1.DSI1_CLK_P
DSI1_D0_N: U7.A17(MIPI_DSI_D0_N) ; port DSI1.DSI1_D0_N
DSI1_D0_P: U7.B17(MIPI_DSI_D0_P) ; port DSI1.DSI1_D0_P
DSI1_D1_N: U7.A16(MIPI_DSI_D1_N) ; port DSI1.DSI1_D1_N
DSI1_D1_P: U7.B16(MIPI_DSI_D1_P) ; port DSI1.DSI1_D1_P
DSI1_D2_N: U7.A18(MIPI_DSI_D2_N) ; port DSI1.DSI1_D2_N
DSI1_D2_P: U7.B18(MIPI_DSI_D2_P) ; port DSI1.DSI1_D2_P
DSI1_D3_N: U7.A15(MIPI_DSI_D3_N) ; port DSI1.DSI1_D3_N
DSI1_D3_P: U7.B15(MIPI_DSI_D3_P) ; port DSI1.DSI1_D3_P
PCIE1_CLK_N: U7.F24(PCIE2_REF_PAD_CLK_N) ; port PCIe1.PCIE1_CLK_N
PCIE1_CLK_P: U7.F25(PCIE2_REF_PAD_CLK_P) ; port PCIe1.PCIE1_CLK_P
PCIE1_RX_N: U7.H24(PCIE1_RXN_N) ; port PCIe1.PCIE1_RX_N
PCIE1_RX_P: U7.H25(PCIE1_RXN_P) ; port PCIe1.PCIE1_RX_P
PCIE1_TX_N: C224.2 ; port PCIe1.PCIE1_TX_N
PCIE1_TX_P: C225.2 ; port PCIe1.PCIE1_TX_P
PCIE1C_TX_C_N: C224.1 U7.J24(PCIE1_TXN_N)
PCIE1C_TX_C_P: C225.1 U7.J25(PCIE1_TXN_P)
PCIE2_CLK_N: U7.K24(PCIE1_REF_PAD_CLK_N) ; port PCIe1.PCIE2_CLK_N
PCIE2_CLK_P: U7.K25(PCIE1_REF_PAD_CLK_P) ; port PCIe1.PCIE2_CLK_P
PCIE2_RX_N: U7.D24(PCIE2_RXN_N) ; port PCIe1.PCIE2_RX_N
PCIE2_RX_P: U7.D25(PCIE2_RXN_P) ; port PCIe1.PCIE2_RX_P
PCIE2C_TX_C_N: C226.1 U7.E24(PCIE2_TXN_N)
PCIE2C_TX_C_P: C227.1 U7.E25(PCIE2_TXN_P)
USB1_D1_N: R88.1 U7.B14(USB1_DN)
USB1_D1_P: R89.1 U7.A14(USB1_DP)
USB1_D_N: R88.2 ; port USB1.USB1_D_N
USB1_D_P: R89.2 ; port USB1.USB1_D_P
USB1_TUNE: R90.1 U7.A11(USB1_RESREF)
USB1_VBUS: R86.1 U7.D14(USB1_VBUS)
USB2_C_TX_N: C228.1 U7.B9(USB2_TX_N)
USB2_C_TX_P: C229.1 U7.A9(USB2_TX_P)
USB2_D2_N: U7.B10(USB2_DN) ; port USB2.USB2_D_N
USB2_D2_P: U7.A10(USB2_DP) ; port USB2.USB2_D_P
USB2_RX_N: U7.B8(USB2_RX_N) ; port USB2.USB2_RX_N
USB2_RX_P: U7.A8(USB2_RX_P) ; port USB2.USB2_RX_P
USB2_TUNE: R91.1 U7.B11(USB2_RESREF)
USB2_TX_N: C228.2 ; port USB2.USB2_TX_N
USB2_TX_P: C229.2 ; port USB2.USB2_TX_P
USB2_VBUS: R166.1 U7.D9(USB2_VBUS)
NetC226_2: C226.2 ; port PCIe1.PCIE2_TX_N
NetC227_2: C227.2 ; port PCIe1.PCIE2_TX_P
NetR84_1: R84.1 U7.G25(PCIE1_RESREF)
NetR85_1: R85.1 U7.C25(PCIE2_RESREF)
NetR87_2: R87.2 U7.P1(HDMI_REXT)
NetR166_2: R166.2 ; port USB2.USB2_VBUS
NetTP35_1: TP35.1 U7.C14(USB1_ID)
NetTP36_1: TP36.1 U7.C9(USB2_ID)

Not connected (* = marked no-connect by the designer): U7 A12(USB1_RX_P)* A13(USB1_TX_P)* B12(USB1_RX_N)* B13(USB1_TX_N)* C17(MIPI_DSI_REXT)* V1(HDMI_AUX_P)* V2(HDMI_AUX_N)*

### Layout directives
differential pair; differential pair class DIFF100: BB_CON_CAM1_CLK_N, BB_CON_CAM1_CLK_P, BB_CON_CAM1_D0_N, BB_CON_CAM1_D0_P, BB_CON_CAM1_D1_N, BB_CON_CAM1_D1_P, BB_CON_CAM1_D2_N, BB_CON_CAM1_D2_P, BB_CON_CAM1_D3_N, BB_CON_CAM1_D3_P, BB_CON_CAM2_CLK_N, BB_CON_CAM2_CLK_P, BB_CON_CAM2_D0_N, BB_CON_CAM2_D0_P, BB_CON_CAM2_D1_N, BB_CON_CAM2_D1_P, BB_CON_CAM2_D2_N, BB_CON_CAM2_D2_P, BB_CON_CAM2_D3_N, BB_CON_CAM2_D3_P, BB_CON_HDMI0_CLK_N, BB_CON_HDMI0_CLK_P, BB_CON_HDMI0_TX0_N, BB_CON_HDMI0_TX0_P, BB_CON_HDMI0_TX1_N, BB_CON_HDMI0_TX1_P, BB_CON_HDMI0_TX2_N, BB_CON_HDMI0_TX2_P, BB_CON_HDMI0_TX3_N, BB_CON_HDMI0_TX3_P, DSI1_CLK_N, DSI1_CLK_P, DSI1_D0_N, DSI1_D0_P, DSI1_D1_N, DSI1_D1_P, DSI1_D2_N, DSI1_D2_P, DSI1_D3_N, DSI1_D3_P
differential pair; differential pair class DIFF85: NetC226_2, NetC227_2, PCIE1_CLK_N, PCIE1_CLK_P, PCIE1_RX_N, PCIE1_RX_P, PCIE1_TX_N, PCIE1_TX_P, PCIE1C_TX_C_N, PCIE1C_TX_C_P, PCIE2_CLK_N, PCIE2_CLK_P, PCIE2_RX_N, PCIE2_RX_P
differential pair; differential pair class DIFF90: USB1_D1_N, USB1_D1_P, USB1_D_N, USB1_D_P, USB2_C_TX_N, USB2_C_TX_P, USB2_D2_N, USB2_D2_P, USB2_RX_N, USB2_RX_P, USB2_TX_N, USB2_TX_P

### Notes on the sheet
- i.MX 8M PHYs
- PCIe1
- HMDI
- (No used to Dashcam)
- PCIe2
- USB1
- (To USB dbg)
- DSI
- USB2
- (To Base Board)
- CSI1
- CSI2
- PCB Des :
- Approv By :
- Project Title :
- Sheet Title :
- Date :
- Page :
- PCB Version :
- PCB Revision :
- Size :
- A2
- (in symbol IC_MPU_ARM_1.5GHZ_MIMX8MD6DVAJZAB, part J) i.MX8M - CSI
- (in symbol IC_MPU_ARM_1.5GHZ_MIMX8MD6DVAJZAB, part K) i.MX8M - HDMI
- (in symbol IC_MPU_ARM_1.5GHZ_MIMX8MD6DVAJZAB, part L) i.MX8M - PCIe
- (in symbol IC_MPU_ARM_1.5GHZ_MIMX8MD6DVAJZAB, part M) i.MX8M - DSI
- (in symbol IC_MPU_ARM_1.5GHZ_MIMX8MD6DVAJZAB, part N) i.MX8M - USB

### Library data of the parts
C224-C229 = CAP_100nF_10V_X5R_0402: Multilayer Ceramic Capacitor, 0.1 uF, 10 V, ± 10%, X5R, 0402 [1005 Metric]; Manufacturer: Murata; Supplier 1: Digikey; Manufacturer Part Number: GRM155R61A104KA01D; RoHS: Yes; Category: Ceramic Capacitors; Stock 1: 2175825; Pricing 1: 1=0.1, 10=0.033, 50=0.0192, 100=0.0148, 500=0.01118, 1000=0.00878, 2500=0.00798, 5000=0.00734 (USD); Mount: Surface Mount; Case/Package: 0402; Number of Pins: 2; Case Code (Metric): 1005; Min Operating Temperature: -55°C; Max Operating Temperature: 85°C; Tolerance: 10%; Packaging: Tape and Reel; Voltage Rating: 10V; Package Quantity: 1; Dielectric: X5R; Termination: SMD/SMT; Voltage: 10V; Series: GRM; Length: 1mm; Width: 0.02inch; Height: 0.5mm; Thickness: 0.022inch; Depth: 0.5mm; Radiation Hardening: No; Reach SVHC Compliant: No; Lead Free: Lead Free; RoHS Compliant: Yes; ComponentLink1URL: https://datasheet.ciiva.com/162/product-162752.pdf?src-supplier=Digikey; ComponentLink1Description: https://datasheet.ciiva.com/162/product-162752.pdf?src-supplier=Digikey; ComponentLink2URL: https://datasheet.ciiva.com/18102/getdatasheetpartid-74533-18102605.pdf?src-supplier=Verical; ComponentLink2Description: https://datasheet.ciiva.com/18102/getdatasheetpartid-74533-18102605.pdf?src-supplier=Verical; ComponentLink3URL: https://datasheet.ciiva.com/162/partnumbering-e-01-162751.pdf?src-supplier=Digikey; ComponentLink3Description: https://datasheet.ciiva.com/162/partnumbering-e-01-162751.pdf?src-supplier=Digikey; ComponentLink4URL: https://datasheet.ciiva.com/162/partnumbering-e-01-162753.pdf?src-supplier=Digikey; ComponentLink4Description: https://datasheet.ciiva.com/162/partnumbering-e-01-162753.pdf?src-supplier=Digikey; ComponentLink5URL: https://datasheet.ciiva.com/22698/608985-22698411.pdf?src-supplier=Element14; ComponentLink5Description: https://datasheet.ciiva.com/22698/608985-22698411.pdf?src-supplier=Element14; ComponentLink6URL: https://datasheet.ciiva.com/28584/608985-28584203.pdf?src-supplier=Element14; ComponentLink6Description: https://datasheet.ciiva.com/28584/608985-28584203.pdf?src-supplier=Element14; ComponentLink7URL: https://datasheet.ciiva.com/28685/608985-28685384.pdf?src-supplier=Element14; ComponentLink7Description: https://datasheet.ciiva.com/28685/608985-28685384.pdf?src-supplier=Element14; ComponentLink8URL: https://datasheet.ciiva.com/16199/product-16199050.pdf?src-supplier=Future+Electronics; ComponentLink8Description: https://datasheet.ciiva.com/16199/product-16199050.pdf?src-supplier=Future+Electronics; ComponentLink9URL: https://datasheet.ciiva.com/7718/608985-7718999.pdf?src-supplier=Element14; ComponentLink9Description: https://datasheet.ciiva.com/7718/608985-7718999.pdf?src-supplier=Element14; Supplier Part Number 1: 490-1318-1-ND
R84 R85 R87 = RES_8.2K_1%_50mW_0201: Res Thick Film 0201 8.2K Ohm 1% 1/20W ±200ppm/°C Molded SMD Paper T/R; Manufacturer: Yageo; Power Rating: 50mW; Voltage Rating: 25V; Supplier 1: Digikey; Manufacturer Part Number: RC0201FR-078K2L; RoHS: Yes; Category: Chip SMD Resistors; Stock 1: 120132; Pricing 1: 1=0.1, 10=0.027, 50=0.0172, 100=0.0143, 500=0.00988, 1000=0.00854, 5000=0.00629 (USD); Case Code (Metric): 0603; Case Code (Imperial): 0201; Min Operating Temperature: -55°C; Max Operating Temperature: 125°C; Package Quantity: 10000; Packaging: Tape and Reel; Resistor Type: Thick Film; Number of Terminations: 2; Termination: SMD/SMT; Max Power Dissipation: 50mW; Temperature Coefficient: 200ppm/°C; Features: Moisture Resistant; Series: RC; Resistance Tolerance: 1%; Length: 0.024inch; Width: 0.3mm; Height: 0.01inch; Reach SVHC Compliant: No; Lead Free: Lead Free; RoHS Compliant: Yes; ComponentLink1URL: https://datasheet.ciiva.com/14985/pyu-r-int-thick-7-14985436.pdf?src-supplier=Digikey; ComponentLink1Description: https://datasheet.ciiva.com/14985/pyu-r-int-thick-7-14985436.pdf?src-supplier=Digikey; Supplier Part Number 1: YAG2353CT-ND
R86 R166 = RES_10K_1/12W_1%_0201: as R53 on sheet mx8m_dram; Supplier 1: Digikey; Manufacturer Part Number: RC0201FR-0710KL; RoHS: Yes; Category: Chip SMD Resistors; Stock 1: 12030325; Pricing 1: 1=0.1, 10=0.027, 50=0.0172, 100=0.0143, 500=0.00988, 1000=0.00854, 5000=0.00629 (USD); Case/Package: 0201; Number of Pins: 2NUMBER; Contact Plating: Tin,Matte; Case Code (Metric): 0603; Weight: 6E-06oz; Min Operating Temperature: -55°C; Max Operating Temperature: 125°C; Packaging: Tape and Reel; Package Quantity: 10000; Termination: SMD/SMT; Resistor Type: Thick Film; Series: RC; Number of Terminations: 2; Max Power Dissipation: 50mW; Working Voltage: 25V; Features: Moisture Resistant; Technology: THICK FILM; Resistance Tolerance: 1%; Construction: Rectangular; Voltage Rating (DC): 25V; Length: 0.6mm; Width: 0.012inch; Height: 0.01inch; Depth: 0.3mm; RoHS Compliant: Yes; Reach SVHC Compliant: No; Military Standard: Not; Lead Free: 5697LeadFree; ComponentLink1URL: https://datasheet.ciiva.com/7660/1421516-7660807.pdf?src-supplier=Element14; ComponentLink1Description: https://datasheet.ciiva.com/7660/1421516-7660807.pdf?src-supplier=Element14; ComponentLink2URL: https://datasheet.ciiva.com/46391/1421516-46391339.pdf?src-supplier=Element14; ComponentLink2Description: https://datasheet.ciiva.com/46391/1421516-46391339.pdf?src-supplier=Element14; ComponentLink3URL: https://datasheet.ciiva.com/2467/pyu-r-int-thick-7-2467110.pdf?src-supplier=Digikey; ComponentLink3Description: https://datasheet.ciiva.com/2467/pyu-r-int-thick-7-2467110.pdf?src-supplier=Digikey; ComponentLink4URL: https://datasheet.ciiva.com/2467/pyu-r-int-thick-7-2467111.pdf?src-supplier=Digikey; ComponentLink4Description: https://datasheet.ciiva.com/2467/pyu-r-int-thick-7-2467111.pdf?src-supplier=Digikey; ComponentLink5URL: https://datasheet.ciiva.com/2467/pyu-r-int-thick-7-2467109.pdf?src-supplier=Digikey; ComponentLink5Description: https://datasheet.ciiva.com/2467/pyu-r-int-thick-7-2467109.pdf?src-supplier=Digikey; ComponentLink6URL: https://datasheet.ciiva.com/26829/getdatasheetpartid-421074-26829851.pdf?src-supplier=Verical; ComponentLink6Description: https://datasheet.ciiva.com/26829/getdatasheetpartid-421074-26829851.pdf?src-supplier=Verical; ComponentLink7URL: https://datasheet.ciiva.com/8891/pyu-rc0201-51-rohs-l-8-8891384.pdf?src-supplier=Avnet; ComponentLink7Description: https://datasheet.ciiva.com/8891/pyu-rc0201-51-rohs-l-8-8891384.pdf?src-supplier=Avnet; Supplier Part Number 1: 311-10.0KMCT-ND
R88 R89 = RES_0R_5%_100mW_0402: as R59 on sheet mx8m_cfg; Supplier 1: Mouser; Manufacturer Part Number: ERJ-2GE0R00X; RoHS: Yes; Category: Chip SMD Resistors; Stock 1: 10989354; Pricing 1: 1=0.1, 10=0.013, 50=0.013, 100=0.006, 1000=0.004, 2500=0.003, 10000=0.003 (USD); Mount: Surface Mount; Case/Package: 0402; Contact Plating: Tin; Case Code (Metric): 1005; Size Code: 0402; Min Operating Temperature: -55°C; Max Operating Temperature: 155°C; Resistor Type: Thick Film; Packaging: Cut Tape; Package Quantity: 10000; Number of Terminations: 2; Termination: SMD/SMT; Max Power Dissipation: 100mW; Voltage Rating (DC): 50V; Features: Automotive AEC-Q200; Series: ERJ; Construction: Rectangular; Technology: THICK FILM; Length: 1mm; Width: 0.5mm; Height: 0.35mm; Depth: 0.5mm; Ratings: AEC-Q200; Radiation Hardening: No; Reach SVHC Compliant: No; Military Standard: Not; Lead Free: Lead Free; RoHS Compliant: Yes; ComponentLink1URL: https://datasheet.ciiva.com/11821/0900766b80f806dd-11821176.pdf?src-supplier=Rs; ComponentLink1Description: https://datasheet.ciiva.com/11821/0900766b80f806dd-11821176.pdf?src-supplier=Rs; ComponentLink2URL: https://datasheet.ciiva.com/43460/1678796-43460347.pdf?src-supplier=Farnell; ComponentLink2Description: https://datasheet.ciiva.com/43460/1678796-43460347.pdf?src-supplier=Farnell; ComponentLink3URL: https://datasheet.ciiva.com/46389/1678796-46389518.pdf?src-supplier=Element14; ComponentLink3Description: https://datasheet.ciiva.com/46389/1678796-46389518.pdf?src-supplier=Element14; ComponentLink4URL: https://datasheet.ciiva.com/5959/1678796-5959692.pdf?src-supplier=Farnell; ComponentLink4Description: https://datasheet.ciiva.com/5959/1678796-5959692.pdf?src-supplier=Farnell; ComponentLink5URL: https://datasheet.ciiva.com/28695/1678796-28695758.pdf?src-supplier=Element14; ComponentLink5Description: https://datasheet.ciiva.com/28695/1678796-28695758.pdf?src-supplier=Element14; ComponentLink6URL: https://datasheet.ciiva.com/16783/70260739-16783734.pdf?src-supplier=Allied+Electronics; ComponentLink6Description: https://datasheet.ciiva.com/16783/70260739-16783734.pdf?src-supplier=Allied+Electronics; ComponentLink7URL: https://datasheet.ciiva.com/16778/70260739-16778335.pdf?src-supplier=Allied+Electronics; ComponentLink7Description: https://datasheet.ciiva.com/16778/70260739-16778335.pdf?src-supplier=Allied+Electronics; ComponentLink8URL: https://datasheet.ciiva.com/48531/aoa0000ce1-48531077.pdf?src-supplier=Avnet; ComponentLink8Description: https://datasheet.ciiva.com/48531/aoa0000ce1-48531077.pdf?src-supplier=Avnet; ComponentLink9URL: https://datasheet.ciiva.com/30097/4aoa0000ce1-30097116.pdf?src-supplier=Onlinecomponents.com; ComponentLink9Description: https://datasheet.ciiva.com/30097/4aoa0000ce1-30097116.pdf?src-supplier=Onlinecomponents.com; Supplier Part Number 1: 667-ERJ-2GE0R00X
R90 R91 = RES_200R_1%_50mW_0201: SMD Chip Resistor, 200 Ohm, ± 1%, 50 mW, 0201 [0603 Metric], Thick Film, General Purpose; Manufacturer: Yageo; Voltage Rating: 25V; Power Rating: 50mW; Temperature Coefficient: 200ppm/°C; Supplier 1: Mouser; Manufacturer Part Number: RC0201FR-07200RL; RoHS: Yes; Category: Chip SMD Resistors; Stock 1: 289096; Pricing 1: 1=0.1, 10=0.015, 50=0.015, 100=0.008, 1000=0.006, 10000=0.006 (USD); Case Code (Imperial): 0201; Case Code (Metric): 0603; Size Code: 0201; Min Operating Temperature: -55°C; Max Operating Temperature: 125°C; Package Quantity: 10000; Packaging: Tape and Reel; Termination: SMD/SMT; Number of Terminations: 2; Max Power Dissipation: 50mW; Features: Moisture Resistant; Series: RC; Length: 0.6mm; Width: 0.3mm; Height: 0.23mm; Lead Free: Lead Free; RoHS Compliant: Yes; ComponentLink1URL: http://www.mouser.com/ds/2/447/RC0201-559633.pdf?src-supplier=Mouser; ComponentLink1Description: http://www.mouser.com/ds/2/447/RC0201-559633.pdf?src-supplier=Mouser; ComponentLink2URL: https://datasheet.octopart.com/RC0201FR-07200RL-Yageo-datasheet-164759695.pdf?src-supplier=Future+Electronics; ComponentLink2Description: https://datasheet.octopart.com/RC0201FR-07200RL-Yageo-datasheet-164759695.pdf?src-supplier=Future+Electronics; ComponentLink3URL: http://www.yageo.com/documents/recent/PYu-RC0201_51_RoHS_L_(8).pdf?src-supplier=Future+Electronics; ComponentLink3Description: http://www.yageo.com/documents/recent/PYu-RC0201_51_RoHS_L_(8).pdf?src-supplier=Future+Electronics; ComponentLink4URL: http://www.yageo.com/documents/recent/PYu-RC_Group_51_RoHS_L_10.pdf?src-supplier=Digikey; ComponentLink4Description: http://www.yageo.com/documents/recent/PYu-RC_Group_51_RoHS_L_10.pdf?src-supplier=Digikey; ComponentLink5URL: http://www.yageo.com/documents/recent/PYu-RC_Group_51_RoHS_L_9.pdf?src-supplier=Digikey; ComponentLink5Description: http://www.yageo.com/documents/recent/PYu-RC_Group_51_RoHS_L_9.pdf?src-supplier=Digikey; Supplier Part Number 1: 603-RC0201FR-07200RL
TP35 TP36 = TP_PAD_SMD_Round: as TP23 on sheet mx8m_dram
U7 = IC_MPU_ARM_1.5GHZ_MIMX8MD6DVAJZAB: as U7 on sheet mx8m_dram; Supplier 1: Digikey; Manufacturer Part Number: MIMX8MD6DVAJZAB; RoHS: Yes; Category: Microprocessors; Stock 1: 162; Pricing 1: 1=56.07, 10=46.184, 25=43.716, 90=41.175 (USD); RoHS Compliant: Yes; Supplier Part Number 1: 568-14717-ND